# EAGLE design RM-USB (EAGLE 7.6.0)
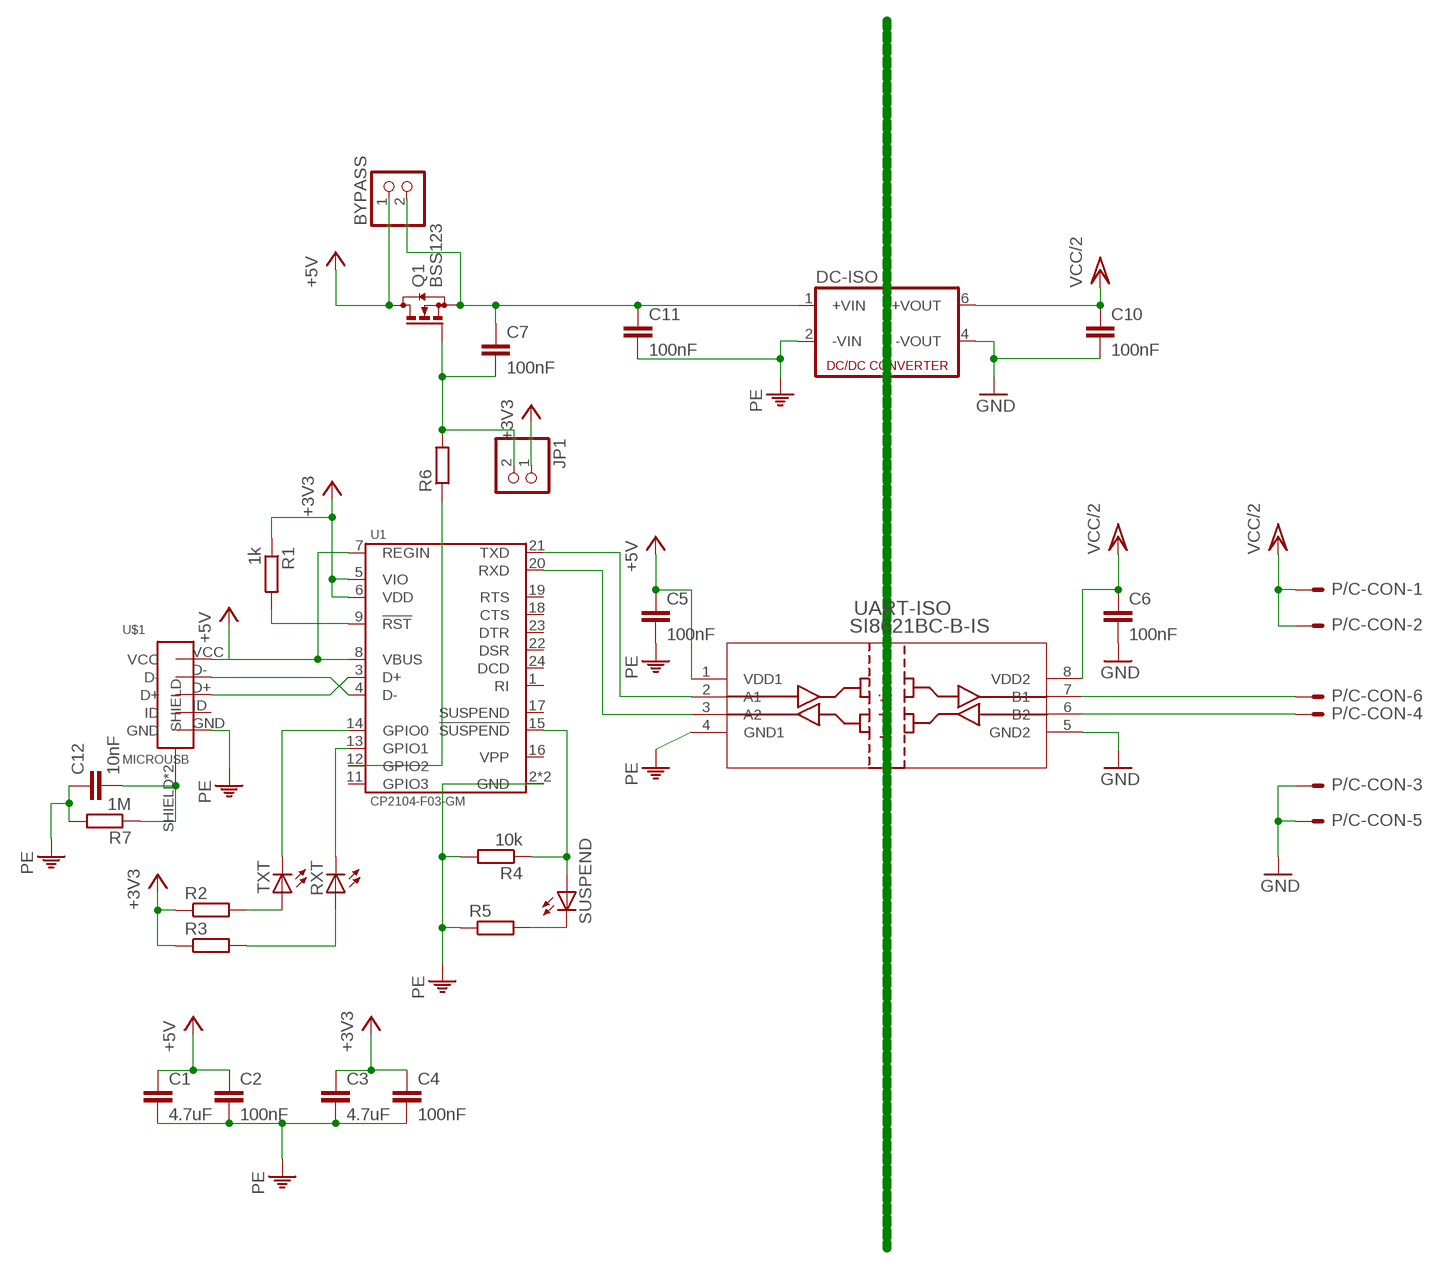
[diagram p0: schematic, sheet 1]

## Parts
BYPASS  PINHD-1X2  [1X02]
C1  4.7uF  C-EUC1206K  [C1206K]
C2  100nF  C-EUC0603  [C0603]
C3  4.7uF  C-EUC1206K  [C1206K]
C4  100nF  C-EUC0603  [C0603]
C5  100nF  C-EUC0603  [C0603]
C6  100nF  C-EUC0603  [C0603]
C7  100nF  C-EUC0603  [C0603]
C10  100nF  C-EUC0603  [C0603]
C11  100nF  C-EUC0603  [C0603]
C12  10nF  C-EUC0603  [C0603]
DC-ISO  NMA  [NMA]
JP1  PINHD-1X2  [1X02]
P/C-CON  ML6EL  [ML6L]
Q1  BSS123  [SOT23]
R1  1k  R-EU_R0603  [R0603]
R2  R-EU_R0603  [R0603]
R3  R-EU_R0603  [R0603]
R4  10k  R-EU_R0603  [R0603]
R5  R-EU_R0603  [R0603]
R6  R-EU_R0603  [R0603]
R7  1M  R-EU_R0603  [R0603]
RXT  LED3MM  [LED3MM]
SUSPEND  LED3MM  [LED3MM]
TXT  LED3MM  [LED3MM]
U1  CP2104-F03-GM  [QFN-24-4X4]
U$1  MICROUSB  [MICROUSB]
UART-ISO  SI8621BC-B-IS  [SOIC-8]

## Nets
+3V3: C3.1 C4.1 JP1.1 R1.1 R2.1 R3.1 U1.5(VIO) U1.6(VDD)
+5V: BYPASS.1 C1.1 C2.1 C5.1 Q1.3(D) U1.7(REGIN) U1.8(VBUS) U$1.VCC UART-ISO.1(VDD1)
GND: C6.2 C10.2 DC-ISO.4(-VOUT) P/C-CON.3 P/C-CON.5 UART-ISO.5(GND2)
N$2: U1.4(D-) U$1.D-
N$3: U1.3(D+) U$1.D+
N$4: R1.2 U1.9(!RST)
N$5: R3.2 RXT.A
N$6: TXT.K(C) U1.14(GPIO0)
N$7: RXT.K(C) U1.13(GPIO1)
N$8: R2.2 TXT.A
N$9: U1.21(TXD) UART-ISO.2(A1)
N$10: U1.20(RXD) UART-ISO.3(A2)
N$11: P/C-CON.4 UART-ISO.6(B2)
N$12: P/C-CON.6 UART-ISO.7(B1)
N$13: R4.1 SUSPEND.A U1.15(!SUSPEND)
N$15: BYPASS.2 C7.1 C11.1 DC-ISO.1(+VIN) Q1.2(S)
N$16: R5.2 SUSPEND.K(C)
N$17: C7.2 JP1.2 Q1.1(G) R6.2
N$20: C12.2 R7.1 U$1.SHIELD U$1.SHIELD1(SHIELD)
N$21: R6.1 U1.12(GPIO2)
PE: C1.2 C2.2 C3.2 C4.2 C5.2 C11.2 C12.1 DC-ISO.2(-VIN) R4.2 R5.1 R7.2 U1.2(GND) U1.PAD(GND) U$1.GND UART-ISO.4(GND1)
VCC/2: C6.1 C10.1 DC-ISO.6(+VOUT) P/C-CON.1 P/C-CON.2 UART-ISO.8(VDD2)
Unconnected: U1.1(RI) U1.11(GPIO3) U1.16(VPP) U1.17(SUSPEND) U1.18(CTS) U1.19(RTS) U1.22(DSR) U1.23(DTR) U1.24(DCD) U$1.ID

## Library data of the parts
BYPASS JP1 = pinhead:PINHD-1X2: PIN HEADER
C1-C7 C10-C12 = rcl:C-EU: CAPACITOR, European symbol
DC-ISO = dc-dc-converter:NMA: DC-DC CONVERTER
P/C-CON = con-harting-ml:ML6E: HARTING
Q1 = transistor-small-signal:BSS123: N-CHANNEL MOS FET
R1-R7 = rcl:R-EU_: RESISTOR, European symbol
RXT SUSPEND TXT = led:LED: LED OSRAM: - CHIPLED LG R971, LG N971, LY N971, LG Q971, LY Q971, LO R971, LY R971 LH N974, LH R974 LS Q976, LO Q976, LY Q976 LO Q996 - Hyper CHIPLED LW Q18S LB Q993, LB Q99A, LB R99A - SideLED LS A670, LO A670, LY A670, LG A670, LP A670 LB A673, LV A673, LT A673, LW A673 LH A674 LY A675 LS A676, LA A676, LO A676, LY A676, LW A676 LS A679, LY A679, LG A679 - Hyper Micro SIDELED® LS Y876, LA Y876, LO Y876, LY Y876 LT Y87S - SmartLED LW L88C, LW L88S LB L89C, LB L89S, LG L890 LS L89K, LO L89K, LY L89K LS L896, LA L896, LO L896, LY L896 - TOPLED LS T670, LO T670, LY T670, LG T670, LP T670 LSG T670, LSP T670, LSY T670, LOP T670, LYG T670 LG T671, LOG T671, LSG T671 LB T673, LV T673, LT T673, LW T673 LH T674 LS T676, LA T676, LO T676, LY T676, LB T676, LH T676, LSB T676, LW T676 LB T67C, LV T67C, LT T67C, LS T67K, LO T67K, LY T67K, LW E67C LS E67B, LA E67B, LO E67B, LY E67B, LB E67C, LV E67C, LT E67C LW T67C LS T679, LY T679, LG T679 LS T770, LO T770, LY T770, LG T770, LP T770 LB T773, LV T773, LT T773, LW T773 LH T774 LS E675, LA E675, LY E675, LS T675 LS T776, LA T776, LO T776, LY T776, LB T776 LHGB T686 LT T68C, LB T68C - Hyper Mini TOPLED® LB M676 - Mini TOPLED Santana® LG M470 LS M47K, LO M47K, LY M47K Source: http://www.osram.convergy.de LUXEON: - LUMILED® LXK2-PW12-R00, LXK2-PW12-S00, LXK2-PW14-U00, LXK2-PW14-V00 LXK2-PM12-R00, LXK2-PM12-S00, LXK2-PM14-U00 LXK2-PE12-Q00, LXK2-PE12-R00, LXK2-PE12-S00, LXK2-PE14-T00, LXK2-PE14-U00 LXK2-PB12-K00, LXK2-PB12-L00, LXK2-PB12-M00, LXK2-PB14-N00, LXK2-PB14-P00, LXK2-PB14-Q00 LXK2-PR12-L00, LXK2-PR12-M00, LXK2-PR14-Q00, LXK2-PR14-R00 LXK2-PD12-Q00, LXK2-PD12-R00, LXK2-PD12-S00 LXK2-PH12-R00, LXK2-PH12-S00 LXK2-PL12-P00, LXK2-PL12-Q00, LXK2-PL12-R00 Source: www.luxeon.com KINGBRIGHT: KA-3528ASYC Source: www.kingbright.com
U1 = Silicon Labs:CP2104
U$1 = musb:MICROUSB
UART-ISO = SI8621:SI8621BC-B-IS

## Board
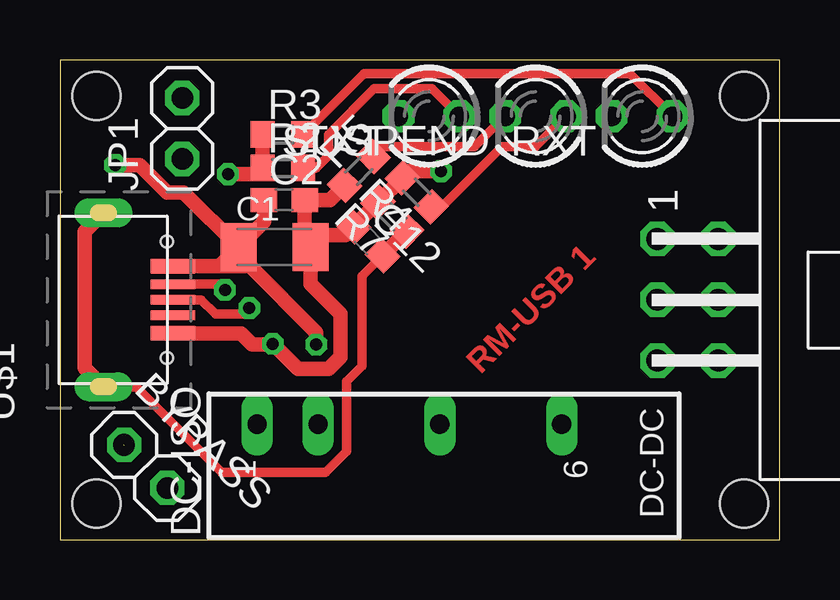
[diagram p1: board, top side]
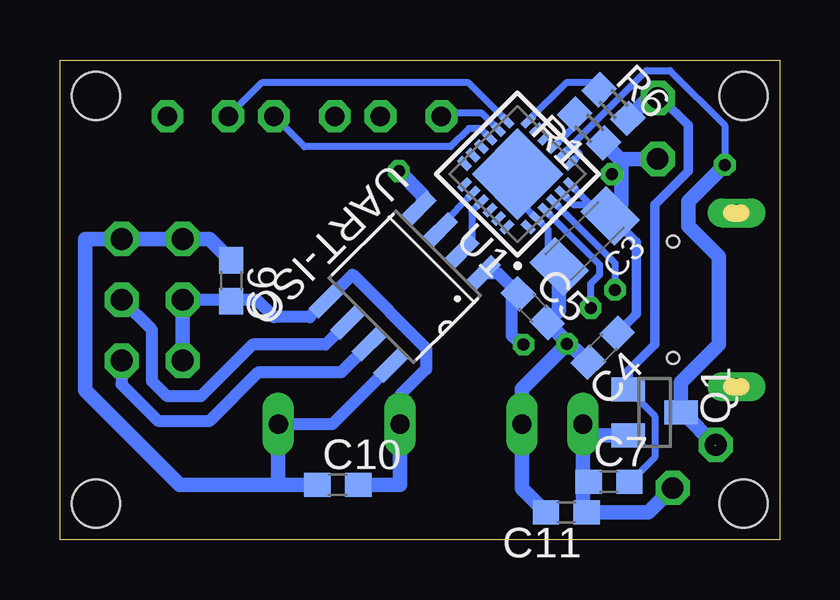
[diagram p2: board, bottom side, seen from below]

Size 30 x 20 mm. Coordinates in mm from the lower left corner, seen from the top.
Outline: 0,0 30,0 30,20 0,20 0,0
Copper layers (1*16): Top 0.035mm / dielectric 1.5mm / Bottom 0.035mm
Design rules "default": minimum track width 10mil, minimum drill 24mil, track to track 8mil, track to pad 8mil, pad to pad 8mil, via to via 8mil, smd to smd 8mil, copper to edge 40mil, drill to drill 8mil, minimum pad ring 10mil, minimum via ring 8mil, stop-mask expansion 4mil, vias tented up to drill 0mil, thermal gap 10mil
Holes 2 mm at 1.5,1.5 1.5,18.5 28.5,1.5 28.5,18.5

### Footprints (pad centres in the part's own frame; a part is rotated, then mirrored left to right if it is on the bottom)
1X02 = drill 0.9 pad 1.422 octagon: 1 -1.27,0; 2 1.27,0
C1206K = smd 1.5 x 2: 1 -1.5,0; 2 1.5,0
C0603 = smd 1.1 x 1: 1 -0.85,0; 2 0.85,0
NMA = drill 0.8 long: 1 -0.27,7.8; 2 -0.27,5.26; 4 -0.27,0.18; 6 -0.27,-4.9
ML6L = drill 0.914 octagon: 1 -2.54,-1.27; 2 -2.54,1.27; 3 0,-1.27; 4 0,1.27; 5 2.54,-1.27; 6 2.54,1.27
SOT23 = smd 1 x 1.4: 1 -0.95,-1.1; 2 0.95,-1.1; 3 0,1.1
R0603 = smd 1 x 1.1: 1 -0.85,0; 2 0.85,0
LED3MM = drill 0.813 octagon: A -1.27,0; K 1.27,0
QFN-24-4X4 = smd 0.6 x 0.3: 1 -1.875,1.25; 2 -1.875,0.75; 3 -1.875,0.25; 4 -1.875,-0.25; 5 -1.875,-0.75; 6 -1.875,-1.25; 13 1.875,-1.25; 14 1.875,-0.75; 15 1.875,-0.25; 16 1.875,0.25; 17 1.875,0.75; 18 1.875,1.25 | smd 0.3 x 0.6: 7 -1.25,-1.875; 8 -0.75,-1.875; 9 -0.25,-1.875; 10 0.25,-1.875; 11 0.75,-1.875; 12 1.25,-1.875; 19 1.25,1.875; 20 0.75,1.875; 21 0.25,1.875; 22 -0.25,1.875; 23 -0.75,1.875; 24 -1.25,1.875 | smd 2.7 x 2.7: PAD 0,0
MICROUSB = smd 0.4 x 1.85: D+ 0,-0.25; D- 0.65,-0.25; ID -0.65,-0.25 | smd 0.6 x 1.85: GND -1.4,-0.25; VCC 1.4,-0.25 | drill 0.7 long: SHIELD 3.625,2.65; SHIELD1 -3.625,2.65 | hole 0.5: -2.425,0; 2.425,0
SOIC-8 = smd 1.55 x 0.6: 1 -2.7,1.905; 2 -2.7,0.635; 3 -2.7,-0.635; 4 -2.7,-1.905; 5 2.7,-1.905; 6 2.7,-0.635; 7 2.7,0.635; 8 2.7,1.905

### Placement (x,y rotation side)
BYPASS  3.56,3.05 315 top
C1  8.92,12.19 0 top
C2  9.33,14.16 0 top
C3  8.13,12.45 225 bottom
C4  7.37,8 225 bottom
C5  10.29,9.65 315 bottom
C6  22.86,10.79 270 bottom
C7  7.11,2.41 0 bottom
C10  18.41,2.29 0 bottom
C11  8.89,1.14 180 bottom
C12  12.83,12.45 315 top
DC-ISO  16,5.08 90 top
JP1  5.08,17.14 90 top
P/C-CON  26.16,10 270 top
Q1  5.21,5.3 270 bottom
R1  7.94,17.14 135 bottom
R2  9.27,15.49 0 top
R3  9.27,16.89 0 top
R4  14.86,14.48 135 top
R5  12.45,15.37 45 top
R6  6.92,18.16 315 bottom
R7  13.84,13.46 135 top
RXT  24.26,17.65 180 top
SUSPEND  19.81,17.65 180 top
TXT  15.37,17.65 180 top
U1  10.92,15.24 135 bottom
U$1  4.45,10 90 top
UART-ISO  15.62,10.54 225 bottom

### Tracks (layer width: path | path; a pad name or v marks a point on that pad's centre or on a via)
+3V3  (via drill 0.5)
  Top 0.6: R3.1 R2.1 8.42,15.24 v6.99,15.24
  Bottom 0.3: 7.88,13.96 U1.6 7.88,13.97 6.6,13.97 | 7.88,13.96 7.42,13.51 C3.1 | U1.5 8.59,13.96 7.88,13.96
  Bottom 0.4: C4.1 5.97,9.4 5.97,12.41 C3.1
  Bottom 0.6: 7.02,13.55 C3.1 | 7.34,16.34 R1.1 6.6,15.81 | 6.6,13.97 6.6,15.24 | 6.6,15.24 6.6,15.81 | v6.99,15.24 6.6,15.24 | 6.6,15.81 6.6,15.88 JP1.1
+5V  (via drill 0.5)  (1 unrouted)
  Top 0.5: v10.67,8.13 10.67,8.38
  Top 0.6: U$1.VCC 6.63,11.4 | 6.63,11.4 C1.1 | C1.1 8.48,13.25 C2.1 | 6.63,11.4 7.9,11.4 10.67,8.64 v10.67,8.13 | v2.29,15.62 3.3,15.62 4.45,14.48 5.14,14.48 C1.1
  Bottom 0.3: U1.8 8.68,16.42 | 8.68,16.42 5.54,19.56 4.57,19.56 2.29,17.27 v2.29,15.62 | U1.7 8.33,16.07 8.68,16.41 8.68,16.42
  Bottom 0.5: UART-ISO.1 11.74,11.1 C5.1 11.18,9.96 11.18,8.51 v10.67,8.13
  Bottom 0.6: 2.67,3.94 4.03,5.3 Q1.3 4.11,6.56 2.54,8.13 2.54,11.81 3.81,13.08 3.81,14.1 v2.29,15.62
GND
  Bottom 0.5: 22.86,10 21.81,10 21.08,9.27 19.59,9.27 UART-ISO.5 17.81,11.05 14.73,7.97 14.73,7.11 15.82,6.02 DC-ISO.4 | 22.86,10 P/C-CON.3 | C6.2 22.86,10
  Bottom 0.6: C10.2 15.82,2.29 DC-ISO.4 | P/C-CON.5 P/C-CON.3
N$2  (via drill 0.5)
  Top 0.4: U$1.D- 6.62,10.65 v6.86,10.41
  Bottom 0.3: U1.4 6.86,11.53 v6.86,10.41
N$3  (via drill 0.5)
  Top 0.4: U$1.D+ 5.88,10 6.48,9.4 7.62,9.4 v7.87,9.65
  Bottom 0.3: v7.87,9.65 7.87,10.67 7.49,11.05 7.49,11.46 U1.3
N$4
  Bottom 0.3: U1.9 8.54,17.27 R1.2
N$5
  Top 0.4: R3.2 12.66,19.43 23.75,19.43 RXT.A
N$6
  Bottom 0.3: U1.14 12.4,17.78 13.97,17.78 TXT.K
N$7
  Bottom 0.3: U1.13 12.96,19.05 21.59,19.05 RXT.K
N$8
  Top 0.4: R2.2 10.67,15.49 11.18,16 11.18,16.89 13.08,18.8 15.49,18.8 TXT.A
N$9
  Bottom 0.3: U1.21 12.83,13.69 12.83,12.44 UART-ISO.2
N$10
  Bottom 0.3: U1.20 14.16,13.06 UART-ISO.3
N$11
  Bottom 0.5: UART-ISO.6 18.93,8.13 21.97,8.13 24.13,5.97 25.53,5.97 26.16,6.6 26.16,8.73 P/C-CON.4
N$12
  Bottom 0.5: P/C-CON.6 27.43,6.48 25.91,4.95 23.75,4.95 21.72,6.99 18.28,6.99 UART-ISO.7
N$13
  Top 0.4: R4.1 15.91,13.88 18.41,16.38 19.81,16.38 SUSPEND.A
  Bottom 0.3: U1.15 12.47,17.14 12.95,17.14 13.72,16.38 19.81,16.38 SUSPEND.A
N$15
  Bottom 0.6: Q1.2 7.74,4.35 DC-ISO.1 8.2,2.41 | BYPASS.2 4.58,2.02 5.46,1.14 C11.1 8.2,1.14 8.2,2.41 | C7.1 8.2,2.41
N$16
  Top 0.4: SUSPEND.K 17.27,16.38 13.46,16.38 R5.2
N$17
  Bottom 0.3: Q1.1 5.21,5.15 5.21,3.43 6.22,2.41 C7.2
  Bottom 0.4: Q1.1 6.31,7.03 5.21,8.13 5.21,13.97 3.81,15.37 3.81,17.27 4.95,18.41 JP1.2
  Bottom 0.6: R6.2 5.46,18.41 JP1.2
N$20
  Top 0.4: C12.2 12.57,10.99 12.57,7.24 11.94,6.6 11.94,3.68 11.05,2.79 6.73,2.79 3.15,6.38 U$1.SHIELD1
  Top 0.6: U$1.SHIELD1 1.02,7.15 1.02,12.85 U$1.SHIELD | R7.1 C12.2
N$21
  Bottom 0.3: R6.1 7.87,19.05 8.89,19.05 U1.12
PE  (via drill 0.5)
  Top 0.4: 8.89,8.13 v8.86,8.16
  Top 0.6: 10.18,12.7 10.18,12.19 C1.2 10.42,10.66 11.68,9.4 11.68,7.62 11.18,7.11 9.91,7.11 8.89,8.13 8,8.13 7.53,8.6 U$1.GND | 10.18,12.7 C2.2 11.24,14.16 R5.1 | v15.88,15.37 14.55,15.37 R4.2 R7.2 | R7.2 C12.1 | R7.2 11.88,12.7 10.18,12.7 | 8.82,8.13 v8.86,8.16
  Bottom 0.3: C3.2 9.19,11.73 9.65,12.19 9.65,12.91 U1.2 10.92,14.18 U1.PAD
  Bottom 0.6: C11.2 10.74,2.14 DC-ISO.2 10.74,6.28 8.87,8.15 | C3.2 9.19,9.55 C5.2 9.02,8.38 8.77,8.15 | 8.77,8.15 C4.2 | 8.87,8.15 8.77,8.15 | 8.87,8.15 v8.86,8.16 | v15.88,15.37 14.86,14.35 14.86,14 UART-ISO.4
VCC/2
  Bottom 0.5: UART-ISO.8 18.66,4.81 DC-ISO.6
  Bottom 0.6: C10.1 20.9,2.29 | 20.9,2.29 DC-ISO.6 | 20.9,2.29 25.02,2.29 28.96,6.22 28.96,12.54 P/C-CON.2 P/C-CON.1 23.75,12.54 C6.1
(copper drawn outside any net)
  shapes: Bottom circle x4, Top circle x4

### Text on the board
Top: RM-USB 1